# Altium schematic sheet 06_Misc_1.SchDoc: Misc 1
size A3; Organization: Lime Microsystems; Address1: Surrey Tech Centre; Address2: Guildford GU2 7YG; Address3: Surrey; Address4: United Kingdom; DocumentNumber: 12; Revision: v1.0; SheetNumber: 6; SheetTotal: 12
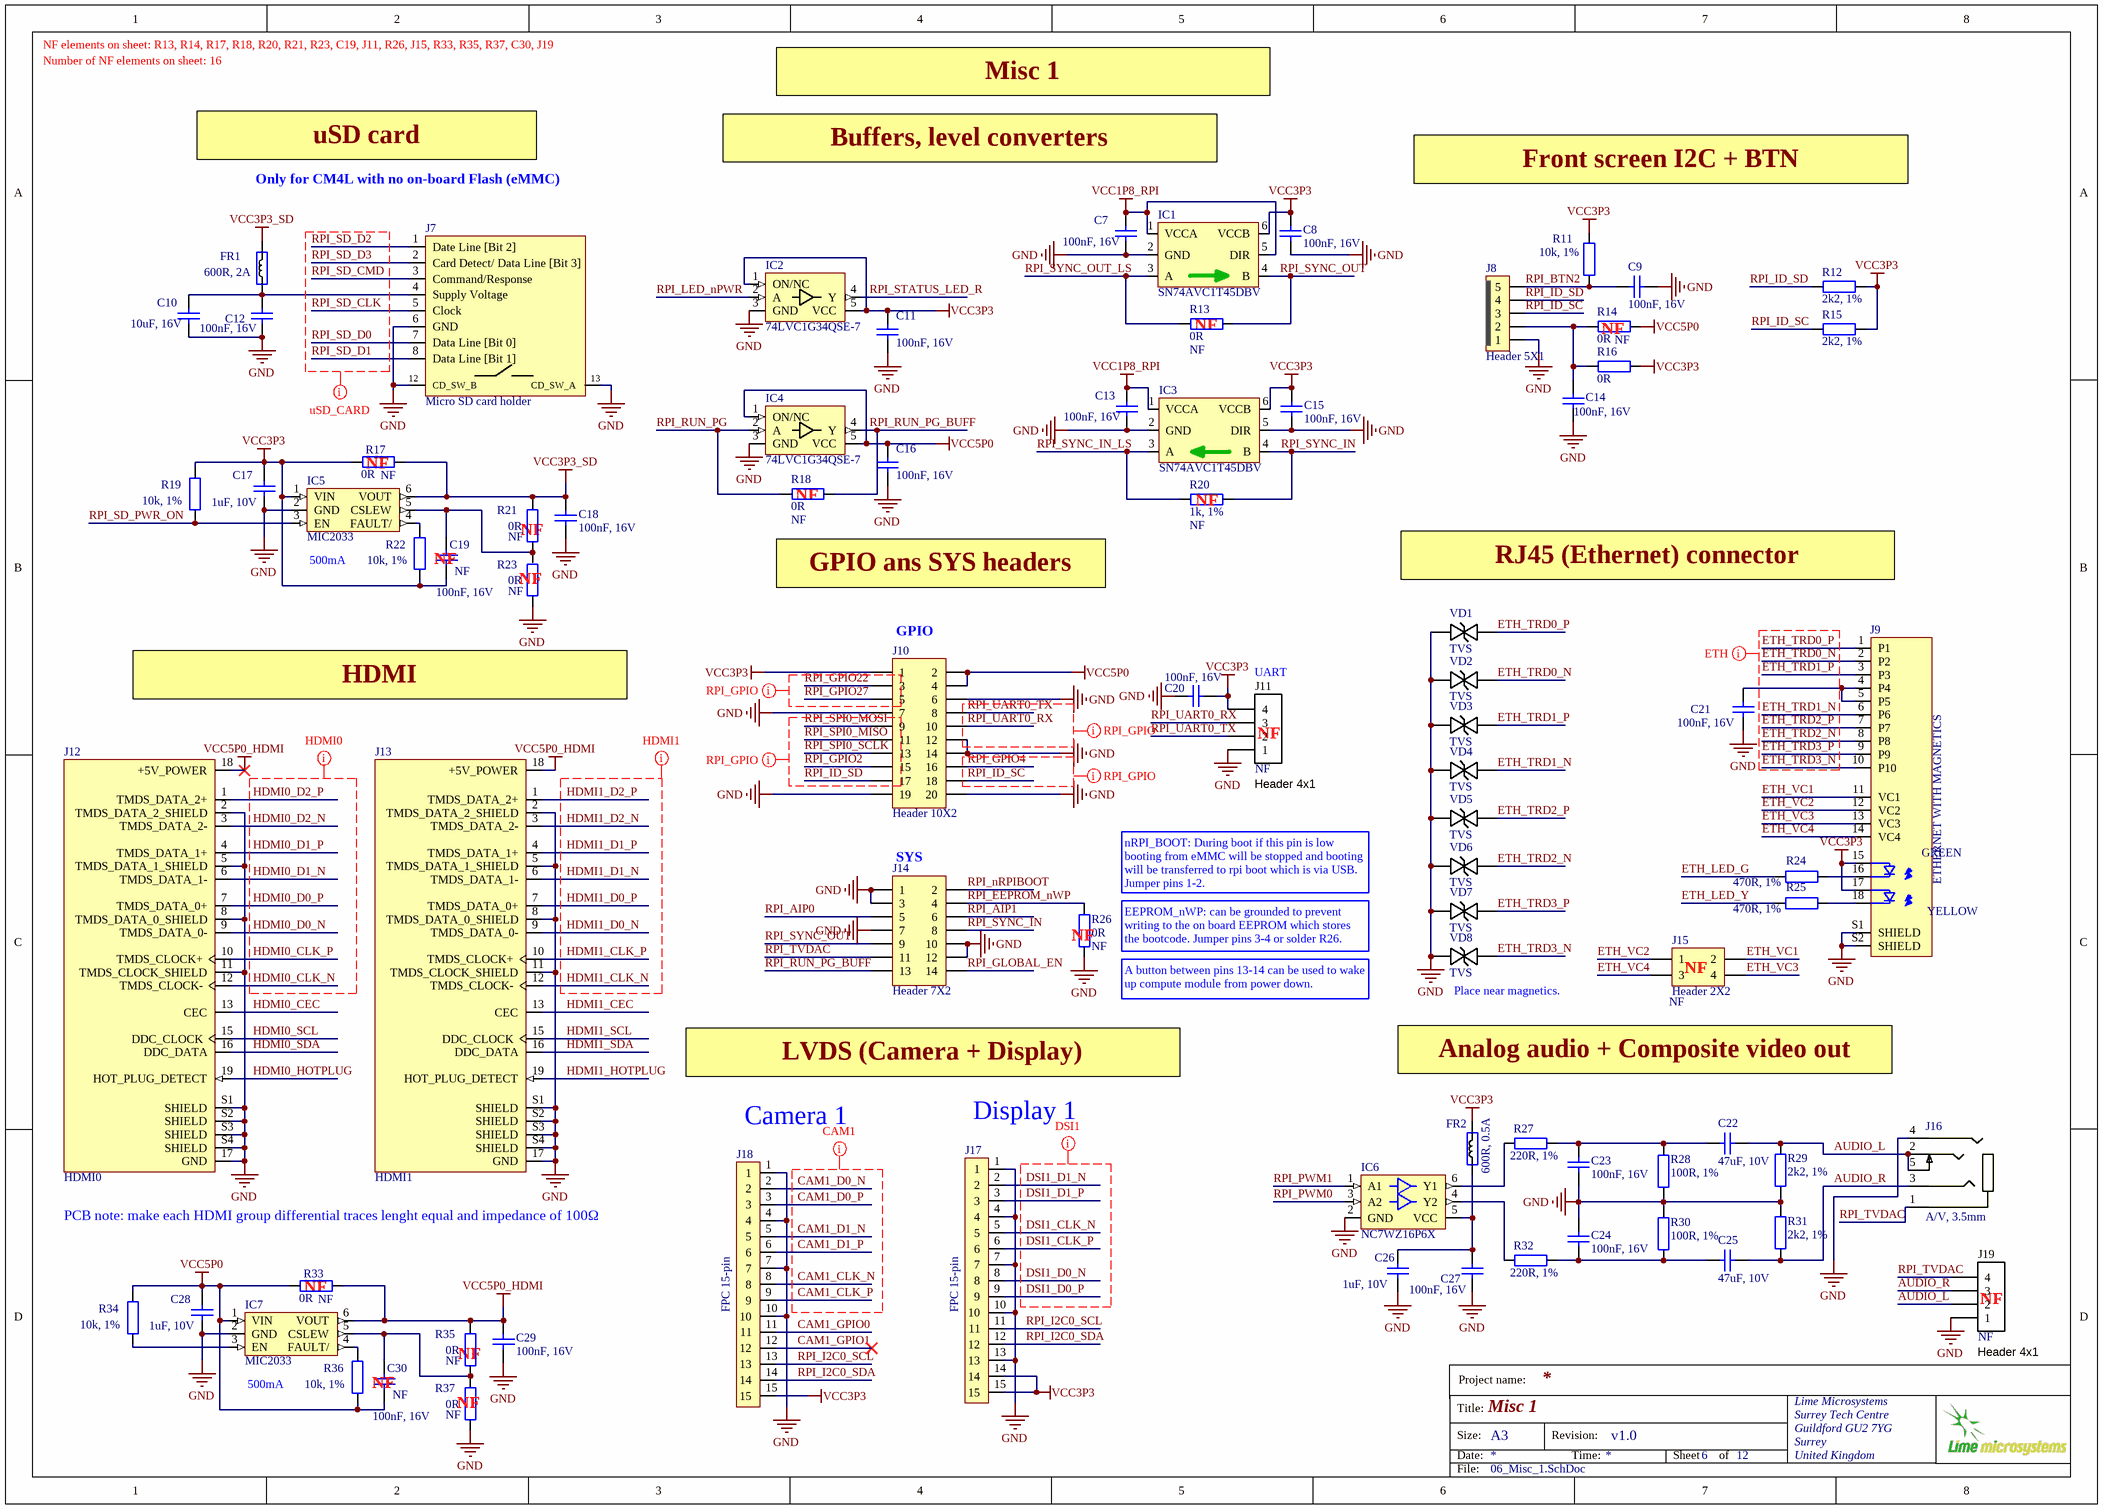
[diagram p0: 06_Misc_1.SchDoc]

## Parts
C7  100nF, 16V  [CAP0402]
C8  100nF, 16V  [CAP0402]
C9  100nF, 16V  [CAP0402]
C10  10uF, 16V  [CAP0603]
C11  100nF, 16V  [CAP0402]
C12  100nF, 16V  [CAP0402]
C13  100nF, 16V  [CAP0402]
C14  100nF, 16V  [CAP0402]
C15  100nF, 16V  [CAP0402]
C16  100nF, 16V  [CAP0402]
C17  1uF, 10V  [CAP0402]
C18  100nF, 16V  [CAP0402]
C19  100nF, 16V  Assembly Info: NF  [CAP0402]
C20  100nF, 16V  [CAP0402]
C21  100nF, 16V  [CAP0402]
C22  47uF, 10V  [CAP1206]
C23  100nF, 16V  [CAP0402]
C24  100nF, 16V  [CAP0402]
C25  47uF, 10V  [CAP1206]
C26  1uF, 10V  [CAP0402]
C27  100nF, 16V  [CAP0402]
C28  1uF, 10V  [CAP0402]
C29  100nF, 16V  [CAP0402]
C30  100nF, 16V  Assembly Info: NF  [CAP0402]
FR1  600R, 2A  [RES0805]
FR2  600R, 0.5A  [RES0402]
IC1  SN74AVC1T45DBV  [SOT23-6]
IC2  74LVC1G34QSE-7  [74AHCT1G126SE-7_BUFFER_SOT353]
IC3  SN74AVC1T45DBV  [SOT23-6]
IC4  74LVC1G34QSE-7  [74AHCT1G126SE-7_BUFFER_SOT353]
IC5  MIC2033  [SOT23-6]
IC6  NC7WZ16P6X  [SC-70_NC7WZ16P6X]
IC7  MIC2033  [SOT23-6]
J7  Micro SD card holder  [MICRO_SD_CARD_114-00841-68_v2]
J8  Header 5X1  [Header1x5_TH_LOCKING]
J9  ETHERNET WITH MAGNETICS  [RJ45_ETHERNET_MAG_A70-112-331N126]
J10  Header 10X2  [HEADER10X2_TH_LOCK]
J11  Header 4x1  Assembly Info: NF  [HEADER4X1_TH]
J12  HDMI0  [HDMI_HD01-19-RA-TH]
J13  HDMI1  [HDMI_HD01-19-RA-TH]
J14  Header 7X2  [Header7x2_TH]
J15  Header 2X2  Assembly Info: NF  [Header2x2_TH]
J16  A/V, 3.5mm  [Audio_jack_3.5mm]
J17  FPC 15-pin  [FPC_CONNECTOR_15pin_1-1734248-5]
J18  FPC 15-pin  [FPC_CONNECTOR_15pin_1-1734248-5]
J19  Header 4x1  Assembly Info: NF  [HEADER4X1_TH]
R11  10k, 1%  [RES0402]
R12  2k2, 1%  [RES0402]
R13  0R  Assembly Info: NF  [RES0402]
R14  0R  Assembly Info: NF  [RES0402]
R15  2k2, 1%  [RES0402]
R16  0R  [RES0402]
R17  0R  Assembly Info: NF  [RES0402]
R18  0R  Assembly Info: NF  [RES0402]
R19  10k, 1%  [RES0402]
R20  1k, 1%  Assembly Info: NF  [RES0402]
R21  0R  Assembly Info: NF  [RES0402]
R22  10k, 1%  [RES0402]
R23  0R  Assembly Info: NF  [RES0402]
R24  470R, 1%  [RES0402]
R25  470R, 1%  [RES0402]
R26  0R  Assembly Info: NF  [RES0402]
R27  220R, 1%  [RES0402]
R28  100R, 1%  [RES0402]
R29  2k2, 1%  [RES0402]
R30  100R, 1%  [RES0402]
R31  2k2, 1%  [RES0402]
R32  220R, 1%  [RES0402]
R33  0R  Assembly Info: NF  [RES0402]
R34  10k, 1%  [RES0402]
R35  0R  Assembly Info: NF  [RES0402]
R36  10k, 1%  [RES0402]
R37  0R  Assembly Info: NF  [RES0402]
VD1  TVS  [SOD323]
VD2  TVS  [SOD323]
VD3  TVS  [SOD323]
VD4  TVS  [SOD323]
VD5  TVS  [SOD323]
VD6  TVS  [SOD323]
VD7  TVS  [SOD323]
VD8  TVS  [SOD323]

## Nets
GND: C7.2 C8.2 C9.2 C10.1 C11.2 C12.2 C13.2 C14.2 C15.2 C16.2 C17.2 C18.2 C20.2 C21.2 C23.2 C24.1 C26.1 C27.2 C28.2 C29.2 IC1.2(GND) IC2.3(GND) IC3.2(GND) IC3.5(DIR) IC4.3(GND) IC5.2(GND) IC6.2(GND) IC7.2(GND) J7.6(GND) J7.12(CD_SW_B) J7.13(CD_SW_A) J8.1 J9.S1(SHIELD) J9.S2(SHIELD) J10.6 J10.7 J10.12 J10.14 J10.19 J10.20 J11.1 J12.2(TMDS_DATA_2_SHIELD) J12.5(TMDS_DATA_1_SHIELD) J12.8(TMDS_DATA_0_SHIELD) J12.11(TMDS_CLOCK_SHIELD) J12.17(GND) J12.S1(SHIELD) J12.S2(SHIELD) J12.S3(SHIELD) J12.S4(SHIELD) J13.2(TMDS_DATA_2_SHIELD) J13.5(TMDS_DATA_1_SHIELD) J13.8(TMDS_DATA_0_SHIELD) J13.11(TMDS_CLOCK_SHIELD) J13.17(GND) J13.S1(SHIELD) J13.S2(SHIELD) J13.S3(SHIELD) J13.S4(SHIELD) J14.1 J14.3 J14.7 J14.10 J14.12 J16.4 J17.1 J17.4 J17.7 J17.10 J17.13 J18.1 J18.4 J18.7 J18.10 J19.1 R23.1 R26.1 R28.1 R29.2 R30.2 R31.1 R37.1 VD1.K VD2.K VD3.K VD4.K VD5.K VD6.K VD7.K VD8.K
VCC1P8_RPI: C7.1 C13.1 IC1.1(VCCA) IC1.5(DIR) IC3.1(VCCA)
VCC3P3: C8.1 C11.1 C15.1 C17.1 C19.2 C20.1 FR2.2 IC1.6(VCCB) IC2.1(ON/NC) IC2.5(VCC) IC3.6(VCCB) IC5.1(VIN) J9.15(G_A) J9.17(Y_A) J10.1 J11.4 J17.14 J17.15 J18.15 R11.1 R12.2 R15.2 R16.1 R17.2 R19.2 R22.1
VCC3P3_SD: C18.1 FR1.2 IC5.6(VOUT) R17.1 R21.2
VCC5P0: C16.1 C28.1 C30.2 IC4.1(ON/NC) IC4.5(VCC) IC7.1(VIN) J10.2 J10.4 R14.1 R33.2 R34.2 R36.1
VCC5P0_HDMI: C29.1 IC7.6(VOUT) J12.18(+5V_POWER) J13.18(+5V_POWER) R33.1 R35.2
AUDIO_L: C22.1 J16.2 J16.5 J19.2 R29.1
AUDIO_R: C25.1 J16.3 J19.3 R31.2
CAM1_CLK_N: J18.8
CAM1_CLK_P: J18.9
CAM1_D0_N: J18.2
CAM1_D0_P: J18.3
CAM1_D1_N: J18.5
CAM1_D1_P: J18.6
CAM1_GPIO0: J18.11
CAM1_GPIO1: J18.12
DSI1_CLK_N: J17.5
DSI1_CLK_P: J17.6
DSI1_D0_N: J17.8
DSI1_D0_P: J17.9
DSI1_D1_N: J17.2
DSI1_D1_P: J17.3
ETH_LED_G: R24.2
ETH_LED_Y: R25.2
ETH_TRD0_N: J9.2(P2) VD2.A
ETH_TRD0_P: J9.1(P1) VD1.A
ETH_TRD1_N: J9.6(P6) VD4.A
ETH_TRD1_P: J9.3(P3) VD3.A
ETH_TRD2_N: J9.8(P8) VD6.A
ETH_TRD2_P: J9.7(P7) VD5.A
ETH_TRD3_N: J9.10(P10) VD8.A
ETH_TRD3_P: J9.9(P9) VD7.A
ETH_VC1: J9.11(VC1) J15.2
ETH_VC2: J9.12(VC2) J15.1
ETH_VC3: J9.13(VC3) J15.4
ETH_VC4: J9.14(VC4) J15.3
HDMI0_CEC: J12.13(CEC)
HDMI0_CLK_N: J12.12(TMDS_CLOCK-)
HDMI0_CLK_P: J12.10(TMDS_CLOCK+)
HDMI0_D0_N: J12.9(TMDS_DATA_0-)
HDMI0_D0_P: J12.7(TMDS_DATA_0+)
HDMI0_D1_N: J12.6(TMDS_DATA_1-)
HDMI0_D1_P: J12.4(TMDS_DATA_1+)
HDMI0_D2_N: J12.3(TMDS_DATA_2-)
HDMI0_D2_P: J12.1(TMDS_DATA_2+)
HDMI0_HOTPLUG: J12.19(HOT_PLUG_DETECT)
HDMI0_SCL: J12.15(DDC_CLOCK)
HDMI0_SDA: J12.16(DDC_DATA)
HDMI1_CEC: J13.13(CEC)
HDMI1_CLK_N: J13.12(TMDS_CLOCK-)
HDMI1_CLK_P: J13.10(TMDS_CLOCK+)
HDMI1_D0_N: J13.9(TMDS_DATA_0-)
HDMI1_D0_P: J13.7(TMDS_DATA_0+)
HDMI1_D1_N: J13.6(TMDS_DATA_1-)
HDMI1_D1_P: J13.4(TMDS_DATA_1+)
HDMI1_D2_N: J13.3(TMDS_DATA_2-)
HDMI1_D2_P: J13.1(TMDS_DATA_2+)
HDMI1_HOTPLUG: J13.19(HOT_PLUG_DETECT)
HDMI1_SCL: J13.15(DDC_CLOCK)
HDMI1_SDA: J13.16(DDC_DATA)
RPI_AIP0: J14.5
RPI_AIP1: J14.6
RPI_BTN2: C9.1 J8.5 R11.2
RPI_EEPROM_nWP: J14.4 R26.2
RPI_GLOBAL_EN: J14.14
RPI_GPIO2: J10.15
RPI_GPIO4: J10.16
RPI_GPIO22: J10.3
RPI_GPIO27: J10.5
RPI_I2C0_SCL: J17.11 J18.13
RPI_I2C0_SDA: J17.12 J18.14
RPI_ID_SC: J8.3 J10.18 R15.1
RPI_ID_SD: J8.4 J10.17 R12.1
RPI_LED_nPWR: IC2.2(A)
RPI_nRPIBOOT: J14.2
RPI_PWM0: IC6.3(A2)
RPI_PWM1: IC6.1(A1)
RPI_RUN_PG: IC4.2(A) R18.2
RPI_RUN_PG_BUFF: IC4.4(Y) J14.13 R18.1
RPI_SD_CLK: J7.5(Clock)
RPI_SD_CMD: J7.3(Command/Response)
RPI_SD_D0: J7.7(Data_Line_[Bit_0])
RPI_SD_D1: J7.8(Data_Line_[Bit_1])
RPI_SD_D2: J7.1(Date_Line_[Bit_2])
RPI_SD_D3: J7.2(Card_Detect/_Data_Line_[Bit_3])
RPI_SD_PWR_ON: IC5.3(EN) R19.1
RPI_SPI0_MISO: J10.11
RPI_SPI0_MOSI: J10.9
RPI_SPI0_SCLK: J10.13
RPI_STATUS_LED_R: IC2.4(Y)
RPI_SYNC_IN: IC3.4(B) J14.8 R20.2
RPI_SYNC_IN_LS: IC3.3(A) R20.1
RPI_SYNC_OUT: IC1.4(B) J14.9 R13.1
RPI_SYNC_OUT_LS: IC1.3(A) R13.2
RPI_TVDAC: J14.11 J16.1 J19.4
RPI_UART0_RX: J10.10 J11.3
RPI_UART0_TX: J10.8 J11.2
NetC10_2: C10.2 C12.1 FR1.1 J7.4(Supply_Voltage)
NetC14_1: C14.1 J8.2 R14.2 R16.2
NetC19_1: C19.1 IC5.5(CSLEW) R21.1 R23.2
NetC21_1: C21.1 J9.4(P4) J9.5(P5)
NetC22_2: C22.2 C23.1 R27.2 R28.2
NetC24_2: C24.2 C25.2 R30.1 R32.2
NetC26_2: C26.2 C27.1 FR2.1 IC6.5(VCC)
NetC30_1: C30.1 IC7.5(CSLEW) R35.1 R37.2
NetIC5_4: IC5.4(FAULT/) R22.2
NetIC6_4: IC6.4(Y2) R32.1
NetIC6_6: IC6.6(Y1) R27.1
NetIC7_3: IC7.3(EN) R34.1
NetIC7_4: IC7.4(FAULT/) R36.2
NetJ9_16: J9.16(G_K) R24.1
NetJ9_18: J9.18(Y_K) R25.1

## Layout directives
net class uSD_CARD: RPI_SD_CLK, RPI_SD_CMD, RPI_SD_D0, RPI_SD_D1, RPI_SD_D2, RPI_SD_D3
net class ETH: ETH_TRD0_N, ETH_TRD0_P, ETH_TRD1_N, ETH_TRD1_P, ETH_TRD2_N, ETH_TRD2_P, ETH_TRD3_N, ETH_TRD3_P
net class CAM1: CAM1_CLK_N, CAM1_CLK_P, CAM1_D0_N, CAM1_D0_P, CAM1_D1_N, CAM1_D1_P
net class DSI1: DSI1_CLK_N, DSI1_CLK_P, DSI1_D0_N, DSI1_D0_P, DSI1_D1_N, DSI1_D1_P
net class HDMI0: HDMI0_CLK_N, HDMI0_CLK_P, HDMI0_D0_N, HDMI0_D0_P, HDMI0_D1_N, HDMI0_D1_P, HDMI0_D2_N, HDMI0_D2_P
net class HDMI1: HDMI1_CLK_N, HDMI1_CLK_P, HDMI1_D0_N, HDMI1_D0_P, HDMI1_D1_N, HDMI1_D1_P, HDMI1_D2_N, HDMI1_D2_P
net class RPI_GPIO: RPI_GPIO2, RPI_GPIO4, RPI_GPIO22, RPI_GPIO27, RPI_ID_SC, RPI_ID_SD, RPI_SPI0_MISO, RPI_SPI0_MOSI, RPI_SPI0_SCLK, RPI_UART0_RX, RPI_UART0_TX

## Notes on the sheet
- Number of NF elements on sheet: 16
- NF elements on sheet: R13, R14, R17, R18, R20, R21, R23, C19, J11, R26, J15, R33, R35, R37, C30, J19
- Misc 1
- uSD card
- Buffers, level converters
- Front screen I2C + BTN
- Only for CM4L with no on-board Flash (eMMC)
- (near R13) NF
- (near R14) NF
- (near R17) NF
- (near R18) NF
- (near R20) NF
- (near IC5) 500mA
- NF
- (near R23) NF
- (near R21) NF
- GPIO ans SYS headers
- RJ45 (Ethernet) connector
- (near J10) GPIO
- HDMI
- (near J11) UART
- (near J11) NF
- (near J14) SYS
- (near R26) nRPI_BOOT: During boot if this pin is low booting from eMMC will be stopped and booting will be transferred to rpi boot which is via USB. Jumper pins 1-2.
- (near R26) NF
- (near R26) EEPROM_nWP: can be grounded to prevent writing to the on board EEPROM which stores the bootcode. Jumper pins 3-4 or solder R26.
- (near J15) NF
- (near R26) A button between pins 13-14 can be used to wake up compute module from power down.
- (near VD8) Place near magnetics.
- LVDS (Camera + Display)
- (near J18) Camera 1
- (near J17) Display 1
- Analog audio + Composite video out
- PCB note: make each HDMI group differential traces lenght equal and impedance of 100Ω
- (near R33) NF
- (near J19) NF
- (near IC7) 500mA
- (near R35) NF
- (near R37) NF
- Project name:
- Title:
- Size:
- Date:
- A3
- Revision:
- Time:
- Sheet
- of
- File:
- (in symbol RJ45_ETHERNET_MAG_A70-112-331N126) GREEN; YELLOW

## Library data of the parts
C7 C8 C11 C13 C15 C16 C21 C23 C24 C27 = Cap_0402: Manufacturer: Murata Electronics; Manufacturer Part Number: GRM155R71C104KA88D; Part Description: 0.10µF ±10% 16V Ceramic Capacitor X7R 0402 (1005 Metric); Tolerance: 10 %; Type: General Purpose MLCC; Capacitance: 0.1 uF; Case Length: 1 mm; Dielectric: X7R; Case Height: 0.5 mm; Temperature Coefficient / Code: +/- 15 %; Value: 100nF, 16V; Supplier 1: Mouser; Supplier Part Number 1: 81-GRM155R71C104KA88; Case Code - in: 0402; RoHS: RoHS Compliant; Operating Temperature Range: - 55 C to + 125 C; Series: GRM; Termination Style: SMD/SMT; Package / Case: 0402 (1005 metric); Voltage Rating DC: 16 V; Maximum Operating Temperature: + 125 C; Case Code - mm: 1005; Minimum Operating Temperature: - 55 C; Product Category: Low & Medium Capacitance SMD Ceramic Chip Capacitors; Packaging: Reel; Product: General Type MLCCs; Category: Multilayer Ceramic Capacitors MLCC - SMD/SMT; Brand: Murata Electronics; Case Width: 0.5 mm; RoHS - Mouser: Y; Standard Pack Qty: 10000; Minimum Order Quantity: 1; Reeling: True; Manufacturer Part Number 1: GRM155R71C104KA88D
C9 C12 C14 C20 = Cap_0603: Manufacturer Part Number 1: GRM155R71C104KA88D; Part Description: 0.10µF ±10% 16V Ceramic Capacitor X7R 0402 (1005 Metric); Brand: Murata Electronics; Tolerance: 10 %; Type: General Purpose MLCC; Capacitance: 0.1 uF; Temperature Coefficient / Code: +/- 15 %; Supplier 1: Mouser; Supplier Part Number 1: 81-GRM155R71C104KA88; Case Code - in: 0402; Manufacturer: Murata Electronics; Category: Multilayer Ceramic Capacitors MLCC - SMD/SMT; Voltage Rating DC: 16 V; Value: 100nF, 16V; Manufacturer Part Number: GRM155R71C104KA88D
  C12 C20: Maximum Operating Temperature: + 125 C; Minimum Operating Temperature: - 55 C; Minimum Order Quantity: 1; Operating Temperature Range: - 55 C to + 125 C; Package / Case: 0402 (1005 metric); Packaging: Reel; Product: General Type MLCCs; Product Category: Low & Medium Capacitance SMD Ceramic Chip Capacitors; Reeling: True; RoHS - Mouser: Y; RoHS: RoHS Compliant; Series: GRM; Standard Pack Qty: 10000; Termination Style: SMD/SMT
C10 = Cap_0603: Manufacturer: Yageo; Manufacturer Part Number 1: GRM188R61C106MA73D; Part Description: 10µF ±20% 16V Ceramic Capacitor X5R 0603 (1608 Metric); Temperature Coefficient: X5R; Capacitance: 10µF; Tolerance: ±20%; Value: 10uF, 16V; Supplier 1: Digi-Key; Supplier Part Number 1: 490-7201-2-ND; Category: Capacitors; Ratings: -; Features: -; Lead Style: -; Package / Case: 0603 (1608 Metric); Lead Spacing: -; Applications: General Purpose; Voltage - Rated: 16V; Operating Temperature: -55°C ~ 85°C; Thickness (Max): 0.039" (1.00mm); Mounting Type: Surface Mount, MLCC; RoHS: RoHS Compliant; Size / Dimension: 0.063" L x 0.031" W (1.60mm x 0.80mm); Packaging: Tape & Reel (TR); Height - Seated (Max): -
C17 C28 = Cap_0402: Manufacturer Part Number 1: CC0402MRX5R6BB105; Manufacturer: Yageo; Part Description: 1µF 10V Ceramic Capacitor X5R 0402 (1005 Metric) 0.039" L x 0.020" W (1.00mm x 0.50mm); Voltage Rating: 10; Capacitance Tolerance: ± 10%; Product Range: TDK - C Series; Ceramic Capacitor Case: 0402 [1005 Metric]; Capacitance: 1; Dielectric Characteristic: X6; Value: 1uF, 10V; Supplier 1: Digi-Key; Supplier Part Number 1: 311-1732-1-ND; MSL: -; RoHS: YES
C18 C19 C29 C30 = Cap_0402: Manufacturer: Murata Electronics; Manufacturer Part Number 1: GRM155R71C104KA88D; Part Description: 0.10µF ±10% 16V Ceramic Capacitor X7R 0402 (1005 Metric); Tolerance: 10 %; Type: General Purpose MLCC; Capacitance: 0.1 uF; Case Length: 1 mm; Dielectric: X7R; Case Height: 0.5 mm; Temperature Coefficient / Code: +/- 15 %; Value: 100nF, 16V; Supplier 1: Mouser; Supplier Part Number 1: 81-GRM155R71C104KA88; Case Code - in: 0402; RoHS: RoHS Compliant; Operating Temperature Range: - 55 C to + 125 C; Series: GRM; Termination Style: SMD/SMT; Package / Case: 0402 (1005 metric); Voltage Rating DC: 16 V; Maximum Operating Temperature: + 125 C; Case Code - mm: 1005; Minimum Operating Temperature: - 55 C; Product Category: Low & Medium Capacitance SMD Ceramic Chip Capacitors; Packaging: Reel; Product: General Type MLCCs; Category: Multilayer Ceramic Capacitors MLCC - SMD/SMT; Brand: Murata Electronics; Case Width: 0.5 mm; RoHS - Mouser: Y; Standard Pack Qty: 10000; Minimum Order Quantity: 1; Reeling: True; Manufacturer Part Number: GRM155R71C104KA88D
C22 C25 = Cap_1206: Manufacturer: TDK Corporation; Manufacturer Part Number 1: C3216X6S1A476M160AC; Part Description: 47µF ±20% 10V Ceramic Capacitor X6S 1206 (3216 Metric); Notification: Current market demand for these product types have resulted in fluctuating and extending lead times. Lead times may differ.; Tolerance: ±20%; Temperature Coefficient: X6S; Value: 47uF, 10V; RoHS: RoHS Compliant; Packaging: Cut Tape (CT); Operating Temperature: -55°C ~ 105°C; Voltage - Rated: 10V; Height - Seated (Max): -; Ratings: -; Applications: General Purpose; Features: Low ESL; Size / Dimension: 0.126" L x 0.063" W (3.20mm x 1.60mm); Supplier 1: Digi-Key; Lead Spacing: -; Supplier Part Number 1: 445-6010-1-ND; Thickness (Max): 0.071" (1.80mm); Failure Rate: -; Category: Capacitors; Lead Style: -; Part Status: Active; Mounting Type: Surface Mount, MLCC; Package / Case: 1206 (3216 Metric)
C26 = Cap_0402: CAP CER 1UF 10V X5R 0402; Manufacturer: Yageo; Part Description: 1µF 10V Ceramic Capacitor X5R 0402 (1005 Metric) 0.039" L x 0.020" W (1.00mm x 0.50mm); Manufacturer Part Number 1: CC0402MRX5R6BB105; Notification: Current market demand for these product types have resulted in fluctuating and extending lead times. Lead times may differ.; Tolerance: ±20%; Value: 1uF, 10V; Supplier 1: Digi-Key; Supplier Part Number 1: 311-1732-1-ND; RoHS: RoHS Compliant; Applications: General Purpose; Category: Capacitors; ComponentLink1Description: http://www.yageo.com/documents/recent/UPY-GPHC_X5R_4V-to-50V_25.pdf; ComponentLink1URL: http://www.yageo.com/documents/recent/UPY-GPHC_X5R_4V-to-50V_25.pdf; Failure Rate: -; Features: -; Height - Seated (Max): -; Lead Spacing: -; Lead Style: -; Mounting Type: Surface Mount, MLCC; Operating Temperature: -55°C ~ 85°C; Package / Case: 0402 (1005 Metric); Packaging: Cut Tape (CT); Part Status: Active; Pricing 1: 1=0.22, 10=0.156, 100=0.0732, 500=0.0513, 1000=0.04248, 2500=0.03953, 5000=0.03617 (USD); Ratings: -; Size / Dimension: 0.039" L x 0.020" W (1.00mm x 0.50mm); Stock 1: 69600; Temperature Coefficient: X5R; Thickness (Max): 0.022" (0.55mm); Voltage - Rated: 10V
FR1 = Ferrite: Manufacturer Part Number 1: MPZ2012S601AT000; Manufacturer: TDK Corporation; Part Description: FERRITE BEAD 600 OHM 0805 1LN; Filter Type: Differential Mode - Single; Impedance @ Frequency: 600 Ohm @ 100MHz; DC Resistance (DCR): 100 mOhm Max; Supplier 1: Digi-Key; Supplier Part Number 1: 445-2206-2-ND; Mounting Type: Surface Mount; RoHS: RoHS Compliant; Height (Max): 0.041" (1.05mm); Packaging: Tape & Reel (TR); Category: Filters; Current Rating: 2A; Package / Case: 0805 (2012 Metric); Size / Dimension: 0.079" L x 0.049" W (2.00mm x 1.25mm)
FR2 = Ferrite: Manufacturer: Murata; Manufacturer Part Number 1: BLM15AX601SN1D; Part Description: - Ferrite Bead 0402 (1005 Metric) 500mA 340mOhm; Tolerance: 25%; Current Rating: 500mA; Number of Lines: 1; DC Resistance (DCR): 340mR; Test Frequency: 100MHz; Value: 600R, 0.5A; Supplier 1: Digi-Key; Supplier Part Number 1: 490-5441-1-ND; Stock 1: 416370; Pricing 1: 1=0.1, 10=0.06, 25=0.0552, 50=0.0496, 100=0.0363, 250=0.0264, 500=0.0242, 1000=0.0209, 5000=0.0165 (USD); Case/Package: 0402; Number of Pins: 2; Case Code (Metric): 1005; Case Code (Imperial): 0402; Core Material: Ferrite; Material: Steel,Ferrite; Min Operating Temperature: -55°C; Max Operating Temperature: 125°C; Package Quantity: 1; Packaging: Tape and Reel; Series: BLM15AX_SN; Impedance: 600R; Max Current Rating: 500mA; Termination: SMD/SMT; Max DC Current: 500mA; Number of Circuits: 1; DC Resistance-Max: 340mR; Length: 1mm; Width: 0.5mm; Height: 0.5mm; Depth: 0.5mm; REACH SVHC: No SVHC; Lead Free: Lead Free; RoHS Compliant: Yes; ComponentLink1URL: https://www.murata.com/en-us/products/productdata/8796740059166/ENFA0018.pdf?src-supplier=Digi-Key; ComponentLink1Description: https://www.murata.com/en-us/products/productdata/8796740059166/ENFA0018.pdf?src-supplier=Digi-Key; ComponentLink2URL: http://search.murata.co.jp/Ceramy/image/img/PDF/ENG/L0110S0100BLM15AX_SN.pdf?src-supplier=Future+Electronics; ComponentLink2Description: http://search.murata.co.jp/Ceramy/image/img/PDF/ENG/L0110S0100BLM15AX_SN.pdf?src-supplier=Future+Electronics; ComponentLink3URL: http://www.produktinfo.conrad.com/datenblaetter/1100000-1199999/001171675-da-01-en-CHIP_DROSSEL0402_600R_420MA_1_0X0_5MM.pdf?src-supplier=Conrad; ComponentLink3Description: http://www.produktinfo.conrad.com/datenblaetter/1100000-1199999/001171675-da-01-en-CHIP_DROSSEL0402_600R_420MA_1_0X0_5MM.pdf?src-supplier=Conrad; ComponentLink4URL: http://www.produktinfo.conrad.com/datenblaetter/1100000-1199999/001172169-da-01-en-DROSSEL_0402_600R_1_0X0_5MM_10000ST.pdf?src-supplier=Conrad; ComponentLink4Description: http://www.produktinfo.conrad.com/datenblaetter/1100000-1199999/001172169-da-01-en-DROSSEL_0402_600R_1_0X0_5MM_10000ST.pdf?src-supplier=Conrad
IC1 IC3 = SN74AVC1T45DBV: Manufacturer: Texas Instruments; Manufacturer Part Number 1: SN74AXC1T45DBVR; Part Description: Voltage Level Translator Bidirectional 1 Circuit 1 Channel 500Mbps SOT-23-6; Number of Bits: 1; Channel Type: Bidirectional; Data Rate: 500Mbps; Supplier 1: Digi-Key; Supplier Part Number 1: 296-47598-1-ND; Stock 1: 116252; Pricing 1: 1=0,68000, 10=0,59800, 25=0,56200, 100=0,45860, 250=0,42596, 500=0,36252, 1000=0,29002 (USD); RoHS: Yes; Mount: Surface Mount; Case/Package: SOT-23-6; Min Operating Temperature: -40°C; Max Operating Temperature: 125°C; Packaging: Cut Tape; Number of Circuits: 1; RoHS Compliant: Yes; ComponentLink1URL: http://www.ti.com/lit/ds/symlink/sn74axc1t45.pdf?src-supplier=Digi-Key; ComponentLink1Description: http://www.ti.com/lit/ds/symlink/sn74axc1t45.pdf?src-supplier=Digi-Key; ComponentLink2URL: http://www.ti.com/general/docs/suppproductinfo.tsp?distId=10&amp;gotoUrl=http%3A%2F%2Fwww.ti.com%2Flit%2Fgpn%2Fsn74axc1t45&src-supplier=Digi-Key; ComponentLink2Description: http://www.ti.com/general/docs/suppproductinfo.tsp?distId=10&amp;gotoUrl=http%3A%2F%2Fwww.ti.com%2Flit%2Fgpn%2Fsn74axc1t45&src-supplier=Digi-Key
IC2 IC4 = 74AHCT1G126SE-7_BUFFER_NON_INV: Part Description: Buffers & Line Drivers Logic LVC 1 Gate SOT353 T&R 3K; Manufacturer: Diodes; ComponentLink1URL: https://datasheet.ciiva.com/12256/74ahct1g126-80154-12256741.pdf?src-supplier=Mouser; ComponentLink1Description: https://datasheet.ciiva.com/12256/74ahct1g126-80154-12256741.pdf?src-supplier=Mouser; ComponentLink2URL: https://datasheet.ciiva.com/26949/getdatasheetpartid-792439-26949318.pdf?src-supplier=Verical; ComponentLink2Description: https://datasheet.ciiva.com/26949/getdatasheetpartid-792439-26949318.pdf?src-supplier=Verical; ComponentLink3URL: https://datasheet.ciiva.com/1832/74ahct1g126-1832523.pdf?src-supplier=Digi-Key; ComponentLink3Description: https://datasheet.ciiva.com/1832/74ahct1g126-1832523.pdf?src-supplier=Digi-Key; ComponentLink4URL: https://datasheet.ciiva.com/1832/74ahct1g126-1832524.pdf?src-supplier=Digi-Key; ComponentLink4Description: https://datasheet.ciiva.com/1832/74ahct1g126-1832524.pdf?src-supplier=Digi-Key; ComponentLink5URL: https://datasheet.ciiva.com/1154/74ahct1g126-1154309.pdf?src-supplier=Element14; ComponentLink5Description: https://datasheet.ciiva.com/1154/74ahct1g126-1154309.pdf?src-supplier=Element14; ComponentLink6URL: https://datasheet.ciiva.com/26939/getdatasheetpartid-779272-26939183.pdf?src-supplier=Verical; ComponentLink6Description: https://datasheet.ciiva.com/26939/getdatasheetpartid-779272-26939183.pdf?src-supplier=Verical; Supplier 1: Mouser; Supplier Part Number 1: 621-74LVC1G34QSE-7; Manufacturer Part Number 1: 74LVC1G34QSE-7; Stock 1: 1171; Pricing 1: 1=0,45000, 10=0,33900, 50=0,33900, 100=0,17800, 1000=0,11200, 10000=0,09400 (USD); RoHS: Yes
IC5 IC7 = MIC2033_power_switch: Manufacturer: Microchip; Manufacturer Part Number 1: MIC2033-05AYM6-TR; Part Description: Power Switch ICs - Power Distribution 500mA High-Side, Power Distribution Switch; Number of Outputs: 1; Interface: On/Off; Max Output Current: 500mA; Fault Protection: Over Temperature; Output Configuration: High Side; Supplier 1: Digi-Key; Supplier Part Number 1: 576-4143-1-ND; Stock 1: 1966; Pricing 1: 1=0,80000, 25=0,65720, 100=0,61500 (USD); RoHS: Yes; Mount: Surface Mount; Case/Package: SOT-23-6; Number of Pins: 6; Min Operating Temperature: -40°C; Max Operating Temperature: 125°C; Packaging: Tape and Reel; Package Quantity: 3000; Series: -; Number of Switches: 1; RoHS Compliant: Yes; ComponentLink1URL: http://www.mouser.com/ds/2/268/mic2033-b-1076865.pdf?src-supplier=Mouser; ComponentLink1Description: http://www.mouser.com/ds/2/268/mic2033-b-1076865.pdf?src-supplier=Mouser; ComponentLink2URL: http://components.arrow.com/part/dataview/56727820S413982N1374?src-supplier=Arrow+Electronics; ComponentLink2Description: http://components.arrow.com/part/dataview/56727820S413982N1374?src-supplier=Arrow+Electronics; ComponentLink3URL: http://www.microchip.com/mymicrochip/filehandler.aspx?ddocname=en579457&src-supplier=Digi-Key; ComponentLink3Description: http://www.microchip.com/mymicrochip/filehandler.aspx?ddocname=en579457&src-supplier=Digi-Key
IC6 = NC7WZ16P6X_DUAL_BUFFER: Manufacturer: Nexperia; Manufacturer Part Number 1: 74LVC2G34GW,125; Part Description: Buffer, Non-Inverting 2 Element 1 Bit per Element Push-Pull Output 6-TSSOP; Supplier 1: Digi-Key; Supplier Part Number 1: 1727-4219-1-ND; Stock 1: 2900; Pricing 1: 1=0,430000, 10=0,321000, 25=0,281200, 100=0,182000, 250=0,150640, 500=0,120520, 1000=0,092400 (USD); RoHS: Yes; RoHS Compliant: Yes; ComponentLink1URL: https://assets.nexperia.com/documents/data-sheet/74LVC2G34.pdf?src-supplier=Digi-Key; ComponentLink1Description: https://assets.nexperia.com/documents/data-sheet/74LVC2G34.pdf?src-supplier=Digi-Key
J7 = MICRO_SD_114-00841-68: Manufacturer: Amphenol Commercial Products; Part Description: 10 (8 + 2) Position Card Connector Secure Digital - microSD™ Surface Mount, Right Angle Gold; Card Type: Secure Digital - microSD™; Number of Positions: 10 (8 + 2); Connector Type: Connector; Insertion, Removal Method: Push In, Pull Out; Supplier 1: Digi-Key; Manufacturer Part Number 1: 114-00841-68; RoHS: RoHS Compliant; Category: Connectors, Interconnects; Stock 1: 5866; Pricing 1: 1=1.5, 10=1.358, 25=1.2752, 50=1.2196, 100=1.1642, 250=1.05336, 500=0.9702 (USD); Packaging: Cut Tape (CT); Part Status: Active; Ejector Side: -; Mounting Type: Surface Mount, Right Angle; Features: Switch; Height Above Board: 0.061" (1.55mm); Mounting Feature: Normal, Standard - Top; Contact Finish: Gold; Contact Finish Thickness: 15.0µin (0.38µm); ComponentLink1URL: https://www.amphenolcanada.com/ProductSearch/drawings/AC/1140084168.pdf; ComponentLink1Description: https://www.amphenolcanada.com/ProductSearch/drawings/AC/1140084168.pdf; Supplier Part Number 1: 114-00841-68-1-ND
J8 = Header 5X1 LOCK: Manufacturer 1: Molex; Manufacturer Part Number: 0022112052; Part Description: Connector Header Through Hole 5 position 0.100" (2.54mm); Supplier 1: Digi-Key; Supplier Part Number 1: WM2703-ND; Stock 1: 17764; Pricing 1: 1=1,01000, 10=0,83600, 100=0,69690, 1000=0,55752, 5000=0,48783, 10000=0,46344 (USD); RoHS: Yes; ComponentLink1URL: https://www.molex.com/pdm_docs/sd/022112052_sd.pdf?src-supplier=Digi-Key; ComponentLink1Description: https://www.molex.com/pdm_docs/sd/022112052_sd.pdf?src-supplier=Digi-Key; Manufacturer: Molex; Manufacturer Part Number 1: 0022112052
J9 = RJ45_ETHERNET_MAG_A70-112-331N126: MagJack A70-112-331N126 or LINK-PP LPJG0926HENL; Part Description: A70-112-331N126 Tab Down Ethernet Magnetic RJ45 Connector LPJG0926HENL With POE +; Manufacturer Part Number 1: LPJG0926HENL; Supplier Part Number 1: LPJG0926HENL; Supplier: Link-PP; Manufacturer: Link-PP
J10 = Header 10X2: Header, 10-Pin, Dual row; Manufacturer: On-Shore Technology; Manufacturer Part Number 1: 302-S201; Part Description: Connector Header Through Hole 20 position 0.100" (2.54mm); Number of Positions: 20; Connector Type: Male Pin; Pitch: 0.1inch; ComponentLink1URL: https://datasheet.ciiva.com/712/901301108-sd-712105.pdf?src-supplier=Digi-Key; ComponentLink1Description: https://datasheet.ciiva.com/712/901301108-sd-712105.pdf?src-supplier=Digi-Key; ComponentLink2URL: https://datasheet.ciiva.com/5153/0901301220-pcb-headers-151695-5153154.pdf?src-supplier=Mouser; ComponentLink2Description: https://datasheet.ciiva.com/5153/0901301220-pcb-headers-151695-5153154.pdf?src-supplier=Mouser; ComponentLink3URL: https://datasheet.ciiva.com/11747/0900766b8002f27a-11747298.pdf?src-supplier=RSComponents; ComponentLink3Description: https://datasheet.ciiva.com/11747/0900766b8002f27a-11747298.pdf?src-supplier=RSComponents; ComponentLink4URL: https://datasheet.ciiva.com/30106/205030901301220-pcb-headers-30106975.pdf?src-supplier=Onlinecomponents.com; ComponentLink4Description: https://datasheet.ciiva.com/30106/205030901301220-pcb-headers-30106975.pdf?src-supplier=Onlinecomponents.com; ComponentLink5URL: https://datasheet.ciiva.com/10076/0901301220-pcb-headers-10076926.pdf?src-supplier=Avnet; ComponentLink5Description: https://datasheet.ciiva.com/10076/0901301220-pcb-headers-10076926.pdf?src-supplier=Avnet; Supplier 1: Digi-Key; Supplier Part Number 1: ED10524-ND; Stock 1: 302635; Pricing 1: 1=0,48000, 10=0,40700, 160=0,31675, 480=0,27148, 960=0,22624, 4960=0,19392, 10080=0,18099 (USD); RoHS: Yes; Mount: Through Hole; Color: Black; Contact Plating: Gold; Number of Rows: 2; Packaging: Tray; Series: 302; Contact Type: Male Pin; Termination: Solder; Row Spacing: 0.1inch; RoHS Compliant: Yes; ComponentLink6URL: https://datasheet.ciiva.com/742/302-sxxx-742190.pdf?src-supplier=Digi-Key; ComponentLink6Description: https://datasheet.ciiva.com/742/302-sxxx-742190.pdf?src-supplier=Digi-Key
J11 J19 = Header4P: Header, 4-pin; Part Description: 4 Positions Header Connector 0.100" (2.54mm) Through Hole Gold; Manufacturer: Wurth Electronics Inc.; Manufacturer Part Number 1: 61300411121; Pitch - Mating: 0.100" (2.54mm); Number of Positions: 4; Number of Positions Loaded: All; Style: Board to Board or Cable; Shrouding: Unshrouded; Contact Length - Mating: 0.236" (6.00mm); Contact Length - Post: 0.118" (3.00mm); Overall Contact Length: 0.454" (11.54mm); Material Flammability Rating: UL94 V-0; Current Rating: 3A; Voltage Rating: 250V; Supplier 1: Digi-Key; Supplier Part Number 1: 732-5317-ND; RoHS: RoHS Compliant; Category: Connectors, Interconnects; Stock 1: 25204; Pricing 1: 1=0.18, 10=0.153, 25=0.1272, 50=0.106, 100=0.096, 1000=0.088 (USD); Packaging: Bulk; Part Status: Active; Connector Type: Header; Contact Type: Male Pin; Number of Rows: 1; Row Spacing - Mating: -; Mounting Type: Through Hole; Termination: Solder; Fastening Type: Push-Pull; Insulation Height: 0.100" (2.54mm); Contact Shape: Square; Contact Finish - Mating: Gold; Contact Finish Thickness - Mating: -; Contact Finish - Post: -; Contact Material: Copper Alloy; Insulation Material: Polybutylene Terephthalate (PBT); Features: -; Operating Temperature: -40°C ~ 125°C; Ingress Protection: -; Insulation Color: Black; Mated Stacking Heights: -; Contact Finish Thickness - Post: -; Applications: -; ComponentLink1URL: http://katalog.we-online.de/em/datasheet/6130xx11121.pdf; ComponentLink1Description: http://katalog.we-online.de/em/datasheet/6130xx11121.pdf
J12 J13 = HDMI_HD01-19-RA-TH: Manufacturer: CUI Devices; Part Description: HDMI HDMI 2.1 Receptacle Connector 19 Position Through Hole, Right Angle; Supplier 1: Digi-Key; Supplier Part Number 1: 2223-HD01-19-RA-TH-ND; Manufacturer Part Number 1: HD01-19-RA-TH; Stock 1: 2182; Pricing 1: 1=2,15000, 10=1,87000, 25=1,79080, 70=1,75100, 140=1,67136, 280=1,51221, 490=1,39282, 980=1,19385, 2450=1,11426 (USD); RoHS: No
J14 = Header 7X2: Header, 7-Pin, Dual row; Manufacturer 1: Adam Equipment; Manufacturer Part Number: PH2-14-UA; Part Description: Connector Header Through Hole 14 position 0.100" (2.54mm); Number of Positions: 14; Pitch: 2.54mm; Supplier 1: Digi-Key; Supplier Part Number 1: 2057-PH2-14-UA-ND; Stock 1: 11861; Pricing 1: 1=0,24000, 10=0,19900, 100=0,15340, 500=0,12976, 1000=0,10617, 5000=0,09437, 10000=0,08553 (USD); RoHS: Yes; Termination: Solder; Lead Free: Lead Free; ComponentLink1URL: https://datasheet.ciiva.com/16397/ph2-14-ua-16397187.pdf?src-supplier=Future+Electronics; ComponentLink1Description: https://datasheet.ciiva.com/16397/ph2-14-ua-16397187.pdf?src-supplier=Future+Electronics; Manufacturer: Adam Equipment; Manufacturer Part Number 1: PH2-14-UA
J15 = Header 2X2: Header, 2-Pin, Dual row; Manufacturer 1: Adam Equipment; Manufacturer Part Number: PH2-04-UA; Part Description: Connector Header Through Hole 4 position 0.100" (2.54mm); Number of Positions: 4; Pitch: 2.54mm; Supplier 1: Digi-Key; Supplier Part Number 1: 2057-PH2-04-UA-ND; Stock 1: 10153; Pricing 1: 1=0,10000, 10=0,06900, 100=0,05120, 500=0,04234, 1000=0,03704, 5000=0,03175, 10000=0,03087 (USD); RoHS: Yes; Termination: Solder; Packaging: Box; Lead Free: Lead Free; ComponentLink1URL: https://datasheet.ciiva.com/16476/catpg250-254-16476106.pdf?src-supplier=Future+Electronics; ComponentLink1Description: https://datasheet.ciiva.com/16476/catpg250-254-16476106.pdf?src-supplier=Future+Electronics; Manufacturer: Adam Equipment; Manufacturer Part Number 1: PH2-04-UA
J16 = AUDIO_JACK_3mm5_SJ-4351X: Manufacturer: CUI Inc.; Manufacturer Part Number 1: SJ-43515TS; Part Description: CONN JACK 4COND 3.5MM R/A; Connector Type: Phone Jack; Gender: Female; Signal Lines: Multiple; Industry Recognized Mating Diameter: 3.50mm (0.141", 1/8", Mini Plug) - Headphone; Actual Diameter: 0.142" (3.60mm); Number of Positions/Contacts: 4 Conductors, 5 Contacts; Internal Switch(s): Single Switch; Shielding: Unshielded; Voltage - Rated: 12VDC; Current Rating: 1A; Mating Length/Depth: 0.551" (14.00mm); Body Color: Black; Supplier 1: Digi-Key; RoHS: RoHS Compliant; Category: Connectors, Interconnects; Stock 1: 62424; Pricing 1: 1=1.04, 10=0.91, 25=0.8568, 50=0.8212, 100=0.7854, 250=0.714, 500=0.6426, 1000=0.5712, 2500=0.51765 (USD); Packaging: Bulk; Part Status: Active; Mounting Type: Through Hole, Right Angle; Termination: Solder; Features: -; Insulation Color: -; Contact Material - Plating: Gold; Body Material: -; Includes: -; Housing Material: Polyamide (PA66), Nylon 6/6; Contact Material: Brass, Copper Alloy, Phosphor Bronze; Cable Opening: -; Panel Hole Size: -; Thread Size: -; Operating Temperature: -20°C ~ 85°C; ComponentLink1URL: http://www.cui.com/product/resource/digikeypdf/sj-4351x.pdf; ComponentLink1Description: http://www.cui.com/product/resource/digikeypdf/sj-4351x.pdf; Supplier Part Number 1: CP-43515TS-ND
J17 J18 = FPC_CONNECTOR_15pin_1-1734248-5: Manufacturer: TE Connectivity; Part Description: 15 Position FPC Connector Contacts, Vertical, 1 Sided 0.039" (1.00mm) Surface Mount; Current Rating: 1A; Voltage Rating: 125V; Gender: Receptacle; Number of Positions: 15; Shielding: Unshielded; Connector Type: Connector,Receptacle,Socket; Wire/Cable Type: Flat Flex; Connector System: Flex-to-Board; Mating Alignment: Yes (With); PCB Mount Alignment: No (Without); PCB Mount Retention: With; Circuit Application: Signal; Pitch: 1mm; Supplier 1: Digi-Key; Manufacturer Part Number 1: 1-1734248-5; Stock 1: 11808; Pricing 1: 1=1.03, 10=0.909, 25=0.8556, 50=0.82, 100=0.7843, 250=0.713, 500=0.6417 (USD); Mount: Surface Mount; Contact Plating: Gold; Contact Material: Bronze; Housing Colour: Black; Housing Material: Thermoplastic; Min Operating Temperature: -4°C; Max Operating Temperature: 185°C; Package Quantity: 1000; Packaging: Tape and Reel; Number of Rows: 1; Termination: SMD/SMT; Number of Contacts: 15; Orientation: Straight; Sealable: No (Without); Shrouded: Yes (With); Contact Current Rating: 1A; Length: 22.4mm; Height: 7.7mm; Width: 4.6mm; Depth: 4.6mm; REACH SVHC: Unknown; ELV: Compliant; Flammability Rating: UL94 V-0; Supplier Part Number 1: A101418DKR-ND
R11 R19 R22 R34 R36 = Res_0402: Manufacturer: Yageo; Manufacturer Part Number 1: RC0402FR-0710KL; Part Description: RES SMD 10K OHM 1% 1/16W 0402; Temperature Coefficient: ±100ppm/°C; Power (Watts): 0.063W, 1/16W; Value: 10k, 1%; Supplier 1: Digi-Key; Supplier Part Number 1: 311-10.0KLRTR-ND; Resistance (Ohms): 10k; Packaging: Tape & Reel (TR); RoHS: RoHS Compliant; Package / Case: 0402 (1005 Metric); Tolerance: ±1%; Operating Temperature: -55°C ~ 155°C; Size / Dimension: 0.039" L x 0.020" W (1.00mm x 0.50mm); Number of Terminations: 2; Category: Resistors; Height: 0.016" (0.40mm); Supplier Device Package: 0402; Features: Moisture Resistant; Composition: Thick Film
R12 R15 R29 R31 = Res_0402: Manufacturer: Stackpole Electronics Inc; Manufacturer Part Number 1: RMCF0402FT2K20; Part Description: RES SMD 2.2K OHM 1% 1/16W 0402; Resistance (Ohms): 2.2k; Temperature Coefficient: ±100ppm/°C; Power (Watts): 0.063W, 1/16W; Value: 2k2, 1%; Supplier 1: Digi-Key; Supplier Part Number 1: RMCF0402FT2K20CT-ND; Supplier Device Package: 0402; Package / Case: 0402 (1005 Metric); Size / Dimension: 0.039" L x 0.020" W (1.00mm x 0.50mm); Operating Temperature: -55°C ~ 155°C; Composition: Thick Film; Category: Resistors; Features: -; Height: 0.016" (0.40mm); RoHS: RoHS Compliant; Number of Terminations: 2; Packaging: Cut Tape (CT); Tolerance: ±1%
R13 R18 R26 = Res_0402: Manufacturer: Yageo; Part Description: RES SMD 0.0OHM JUMPER 1/16W 0402; Manufacturer Part Number 1: RC0402JR-070RL; Power (Watts): 0.063W, 1/16W; Resistance (Ohms): 0.0; Tolerance: Jumper; Supplier 1: Digi-Key; Supplier Part Number 1: 311-0.0JRTR-ND; Composition: Thick Film; Package / Case: 0402 (1005 Metric); Category: Resistors; Value: 0R; Features: Moisture Resistant; Height: 0.016" (0.40mm); Number of Terminations: 2; Operating Temperature: -55°C ~ 155°C; Packaging: Tape & Reel (TR); RoHS: RoHS Compliant; Size / Dimension: 0.039" L x 0.020" W (1.00mm x 0.50mm); Supplier Device Package: 0402; Temperature Coefficient: -
R14 R16 R17 R21 R23 R33 R35 R37 = Res_0402: Manufacturer Part Number 1: RC0402JR-070RL; Manufacturer: Yageo; Part Description: RES SMD 0.0OHM JUMPER 1/16W 0402; Resistance (Ohms): 0.0; Tolerance: Jumper; Power (Watts): 0.063W, 1/16W; Value: 0R; Supplier 1: Digi-Key; Supplier Part Number 1: 311-0.0JRTR-ND; Category: Resistors; Temperature Coefficient: -; Features: Moisture Resistant; Supplier Device Package: 0402; Height: 0.016" (0.40mm); Package / Case: 0402 (1005 Metric); Operating Temperature: -55°C ~ 155°C; Size / Dimension: 0.039" L x 0.020" W (1.00mm x 0.50mm); Composition: Thick Film; Packaging: Tape & Reel (TR); Number of Terminations: 2; RoHS: RoHS Compliant
R20 = Res_0402: Manufacturer: Stackpole Electronics Inc; Manufacturer Part Number 1: RMCF0402FT1K00; Part Description: RES SMD 1K OHM 1% 1/16W 0402; Temperature Coefficient: ±100ppm/°C; Power (Watts): 0.063W, 1/16W; Value: 1k, 1%; Supplier 1: Digi-Key; Supplier Part Number 1: RMCF0402FT1K00TR-ND; Package / Case: 0402 (1005 Metric); Supplier Device Package: 0402; Height: 0.016" (0.40mm); Size / Dimension: 0.039" L x 0.020" W (1.00mm x 0.50mm); Number of Terminations: 2; Packaging: Cut Tape (CT); Category: Resistors; Composition: Thick Film; Resistance (Ohms): 1k; Tolerance: ±1%; Features: Moisture Resistant; Operating Temperature: -55°C ~ 155°C; RoHS: RoHS Compliant
R24 R25 = Res_0402: Manufacturer 1: Yageo; Manufacturer Part Number 1: RC0402FR-07470RL; Part Description: 470 Ohms ±1% 0.063W, 1/16W Chip Resistor 0402 (1005 Metric) Moisture Resistant Thick Film; Power Rating: 62.5mW; Temperature Coefficient: 100ppm/°C; Voltage Rating: 50V; Max Power Dissipation: 63mW; Value: 470R, 1%; Supplier 1: Digi-Key; Supplier Part Number 1: 311-470LRCT-ND; Stock 1: 1652476; Pricing 1: 1=0,10000, 10=0,01600, 100=0,00660, 1000=0,00299, 2500=0,00259, 5000=0,00214 (USD); RoHS: Yes; Case/Package: 0402; Case Code (Metric): 1005; Case Code (Imperial): 0402; Size Code: 0402; Min Operating Temperature: -55°C; Max Operating Temperature: 155°C; Packaging: Tape and Reel; Tolerance: 1%; Resistance: 470R; Number of Terminations: 2; Features: Moisture Resistant; Package Quantity: 1; Resistor Type: Thick Film; Termination: SMD/SMT; Series: RC; Resistance Tolerance: 1%; Construction: Rectangular; Length: 1mm; Width: 0.02inch; Height: 0.016inch; Depth: 0.5mm; Lead Free: Lead Free; REACH SVHC: Unknown; Military Standard: Not; RoHS Compliant: Yes; Manufacturer: Yageo
R27 R32 = Res_0402: Manufacturer: Yageo; Manufacturer Part Number 1: RC0402FR-07220RL; Part Description: 220 Ohms ±1% 0.063W, 1/16W Chip Resistor 0402 (1005 Metric) Moisture Resistant Thick Film; Power Rating: 62.5mW; Voltage Rating: 50V; Temperature Coefficient: 100ppm/°C; Max Power Dissipation: 63mW; Value: 220R, 1%; Supplier 1: Digi-Key; Supplier Part Number 1: 311-220LRCT-ND; Stock 1: 2362142; Pricing 1: 1=0,10000, 10=0,01500, 100=0,00610, 1000=0,00275, 2500=0,00239, 5000=0,00197 (USD); RoHS: Yes; Case/Package: 0402; Number of Pins: 2; Case Code (Imperial): 0402; Case Code (Metric): 1005; Size Code: 0402; Min Operating Temperature: -55°C; Max Operating Temperature: 155°C; Resistance: 220R; Tolerance: 1%; Packaging: Tape and Reel; Voltage Rating (DC): 50V; Termination: SMD/SMT; Resistor Type: Thick Film; Number of Terminations: 2; Features: Moisture Resistant; Series: RC; Resistance Tolerance: 1%; Technology: THICK FILM; Construction: Rectangular; Package Quantity: 1; Length: 1mm; Width: 0.02inch; Height: 0.016inch; Depth: 0.5mm; REACH SVHC: No SVHC; Lead Free: Lead Free; RoHS Compliant: Yes; Military Standard: Not; ComponentLink1URL: https://datasheet.ciiva.com/11819/0900766b80c66297-11819466.pdf?src-supplier=RSComponents; ComponentLink1Description: https://datasheet.ciiva.com/11819/0900766b80c66297-11819466.pdf?src-supplier=RSComponents; ComponentLink2URL: https://datasheet.ciiva.com/2453/pyu-r-int-thick-7-2453461.pdf?src-supplier=Digi-Key; ComponentLink2Description: https://datasheet.ciiva.com/2453/pyu-r-int-thick-7-2453461.pdf?src-supplier=Digi-Key; ComponentLink3URL: https://datasheet.ciiva.com/2453/pyu-r-int-thick-7-2453462.pdf?src-supplier=Digi-Key; ComponentLink3Description: https://datasheet.ciiva.com/2453/pyu-r-int-thick-7-2453462.pdf?src-supplier=Digi-Key; ComponentLink4URL: https://datasheet.ciiva.com/2453/pyu-r-int-thick-7-2453460.pdf?src-supplier=Digi-Key; ComponentLink4Description: https://datasheet.ciiva.com/2453/pyu-r-int-thick-7-2453460.pdf?src-supplier=Digi-Key; ComponentLink5URL: https://datasheet.ciiva.com/16746/pyu-rc0402-51-rohs-l-6-r-16746831.pdf?src-supplier=Future+Electronics; ComponentLink5Description: https://datasheet.ciiva.com/16746/pyu-rc0402-51-rohs-l-6-r-16746831.pdf?src-supplier=Future+Electronics
R28 R30 = Res_0402: Manufacturer Part Number 1: RMCF0402FT100R; Manufacturer: Stackpole Electronics Inc.; Part Description: RES SMD 100 OHM 1% 1/16W 0402; Power (Watts): 0.063W, 1/16W; Temperature Coefficient: ±100ppm/°C; Resistance (Ohms): 100; Value: 100R, 1%; Supplier 1: Digi-Key; Supplier Part Number 1: RMCF0402FT100RDKR-ND; Packaging: Digi-Reel®; Composition: Thick Film; Number of Terminations: 2; Package / Case: 0402 (1005 Metric); RoHS: RoHS Compliant; Category: Resistors; Size / Dimension: 0.039" L x 0.020" W (1.00mm x 0.50mm); Tolerance: ±1%; Supplier Device Package: 0402; Features: -; Height: 0.016" (0.40mm); Operating Temperature: -55°C ~ 155°C
VD1-VD8 = DIODE_TVS: Manufacturer 1: Sangdest Microelectronics; Manufacturer Part Number: SD03LCC; Part Description: 19V Clamp 20A (8/20µs) Ipp Tvs Diode Surface Mount SOD-323; ComponentLink1URL: https://datasheet.ciiva.com/29588/littelfuse-tvs-diode-array-sp4020-datasheet-pdf-29588193.pdf?src-supplier=Digi-Key; ComponentLink1Description: https://datasheet.ciiva.com/29588/littelfuse-tvs-diode-array-sp4020-datasheet-pdf-29588193.pdf?src-supplier=Digi-Key; ComponentLink2URL: https://datasheet.ciiva.com/24111/littelfuse-sp4020-267385-24111169.pdf?src-supplier=Mouser; ComponentLink2Description: https://datasheet.ciiva.com/24111/littelfuse-sp4020-267385-24111169.pdf?src-supplier=Mouser; Supplier 1: Digi-Key; Supplier Part Number 1: 1655-SD03LCCCT-ND; Stock 1: 8808; Pricing 1: 1=0,37000, 10=0,27300, 100=0,15460, 500=0,10240, 1000=0,07851 (USD); RoHS: No; Manufacturer: Sangdest Microelectronics; Manufacturer Part Number 1: SD03LCC